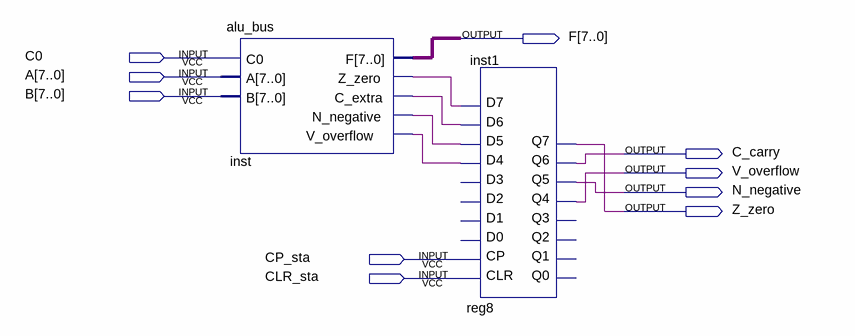
[diagram p0: schematic sheet]
// Quartus schematic alu_sta_bused.bdf as structural Verilog: 2 symbols, 10 pins
module alu_sta_bused (
  input  C0,
  input  [7:0] A,
  input  [7:0] B,
  input  CP_sta,
  input  CLR_sta,
  output [7:0] F,
  output C_carry,
  output V_overflow,
  output N_negative,
  output Z_zero
);

  wire inst_c_extra, inst_n_negative, inst_v_overflow, inst_z_zero;

  alu_bus inst (
    .C0(C0), .A(A), .B(B), .F(F), .Z_zero(inst_z_zero), .C_extra(inst_c_extra), .N_negative(inst_n_negative),
    .V_overflow(inst_v_overflow));
  reg8 inst1 (
    .CLR(CLR_sta), .CP(CP_sta), .D4(inst_v_overflow), .D5(inst_n_negative), .D6(inst_c_extra),
    .D7(inst_z_zero), .Q4(V_overflow), .Q5(N_negative), .Q6(C_carry), .Q7(Z_zero));  // open: D0, D1, D2, D3, Q0, Q1, Q2, Q3
endmodule
